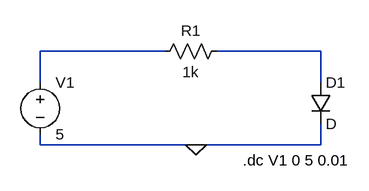
[diagram p0: schematic ltspice 2.asc]
ltspice 2.asc, the LTspice schematic file:
Version 4.1
SHEET 1 880 680
WIRE 208 96 16 96
WIRE 448 96 288 96
WIRE 16 144 16 96
WIRE 448 144 448 96
WIRE 16 240 16 224
WIRE 256 240 16 240
WIRE 448 240 448 208
WIRE 448 240 256 240
FLAG 256 240 0
SYMBOL voltage 16 128 R0
SYMATTR InstName V1
SYMATTR Value 5
SYMBOL res 304 80 R90
WINDOW 0 0 56 VBottom 2
WINDOW 3 32 56 VTop 2
SYMATTR InstName R1
SYMATTR Value 1k
SYMBOL diode 432 144 R0
SYMATTR InstName D1
TEXT 328 264 Left 2 !.dc V1 0 5 0.01

The netlist it stands for:
* ltspice 2.asc
V1 N001 0 5
R1 N002 N001 1k
D1 N002 0 D
.model D D
.lib standard.dio
.dc V1 0 5 0.01
.backanno
.end